# Altium schematic sheet MR26_GSS_6.SchDoc
size 373 x 296 mm; Origin: Eagle; OriginPath: C:\Users\David Nguyen\Downloads\eagle\eagle\MR26_GSS.sch; OriginSheet: 7; OriginDescription: 08 Sensors: IMU, 3x ToF, GNSS
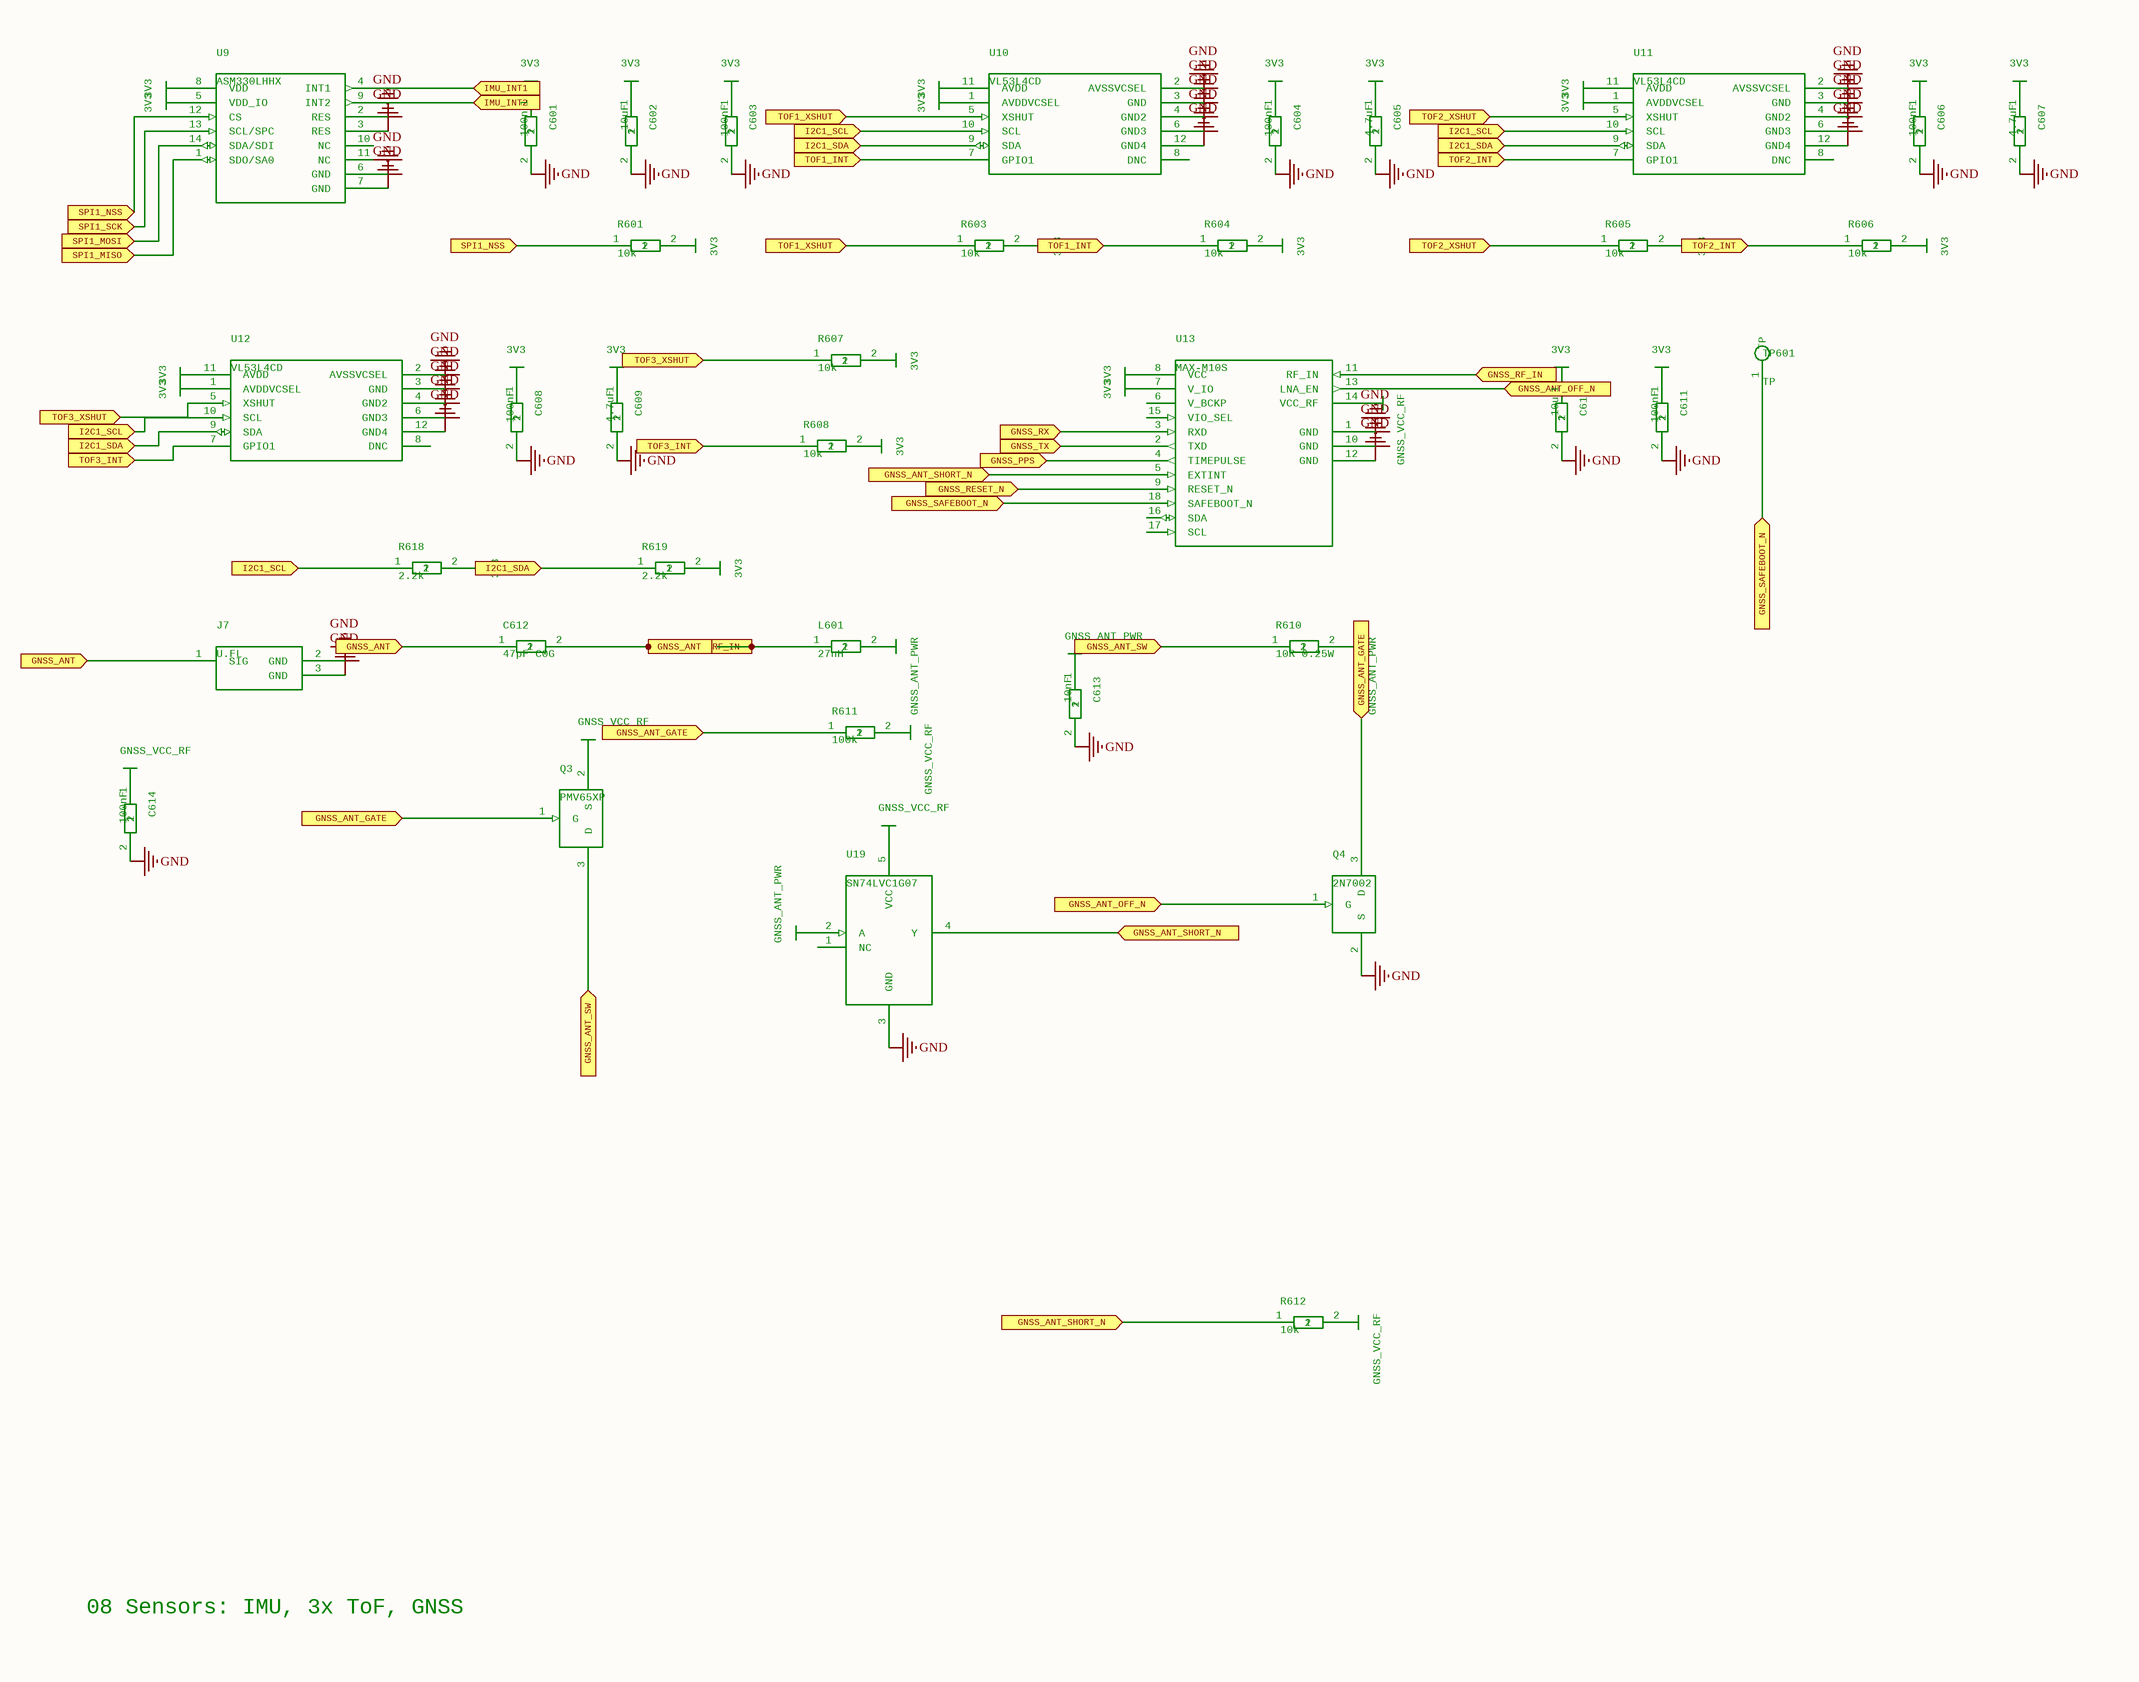
[diagram p0: MR26_GSS_6.SchDoc]

## Parts
C601  100nF  [C_0402]
C602  10uF  [C_0603]
C603  100nF  [C_0402]
C604  100nF  [C_0402]
C605  4.7uF  [C_0603]
C606  100nF  [C_0402]
C607  4.7uF  [C_0603]
C608  100nF  [C_0402]
C609  4.7uF  [C_0603]
C610  10uF  [C_0603]
C611  100nF  [C_0402]
C612  47pF C0G  [C_0402]
C613  10nF  [C_0402]
C614  100nF  [C_0402]
J7  U.FL  [U.FL_Hirose]
L601  27nH  [L_0402]
PWR0492  3V3
PWR0493  3V3
PWR0498  3V3
PWR0500  3V3
PWR0502  3V3
PWR0504  3V3
PWR0505  3V3
PWR0506  3V3
PWR0512  3V3
PWR0514  3V3
PWR0516  3V3
PWR0517  3V3
PWR0518  3V3
PWR0519  3V3
PWR0525  3V3
PWR0527  3V3
PWR0529  3V3
PWR0530  3V3
PWR0531  3V3
PWR0532  3V3
PWR0538  3V3
PWR0540  3V3
PWR0542  3V3
PWR0543  3V3
PWR0544  3V3
PWR0545  3V3
PWR0546  3V3
PWR0547  3V3
PWR0548  GNSS_VCC_RF
PWR0552  3V3
PWR0554  3V3
PWR0558  GNSS_ANT_PWR
PWR0559  GNSS_ANT_PWR
PWR0561  GNSS_ANT_PWR
PWR0562  GNSS_VCC_RF
PWR0563  GNSS_VCC_RF
PWR0565  GNSS_ANT_PWR
PWR0566  GNSS_VCC_RF
PWR0568  GNSS_VCC_RF
PWR0570  GNSS_VCC_RF
Q3  PMV65XP  [SOT-23]
Q4  2N7002  [SOT-23]
R601  10k  [R_0402]
R603  10k  [R_0402]
R604  10k  [R_0402]
R605  10k  [R_0402]
R606  10k  [R_0402]
R607  10k  [R_0402]
R608  10k  [R_0402]
R610  10R 0.25W  [R_0603]
R611  100k  [R_0402]
R612  10k  [R_0402]
R618  2.2k  [R_0402]
R619  2.2k  [R_0402]
TP601  TP  [TP_1.0mm]
U9  ASM330LHHX  [LGA-14L_2.5x3]
U10  VL53L4CD  [VL53L4CD_LGA12]
U11  VL53L4CD  [VL53L4CD_LGA12]
U12  VL53L4CD  [VL53L4CD_LGA12]
U13  MAX-M10S  [u-blox_LCC-18_9.7x10.1]
U19  SN74LVC1G07  [SOT-23-5]

## Ports
GNSS_ANT (in), GNSS_ANT_GATE (in), GNSS_ANT_OFF_N (in), GNSS_ANT_SHORT_N (in), GNSS_ANT_SW (in), GNSS_PPS (in), GNSS_RESET_N (in), GNSS_RF_IN (in), GNSS_RX (in), GNSS_SAFEBOOT_N (in), GNSS_TX (in), I2C1_SCL (in), I2C1_SDA (in), IMU_INT1 (in), IMU_INT2 (in), SPI1_MISO (in), SPI1_MOSI (in), SPI1_NSS (in), SPI1_SCK (in), TOF1_INT (in), TOF1_XSHUT (in), TOF2_INT (in), TOF2_XSHUT (in), TOF3_INT (in), TOF3_XSHUT (in)

## Nets
GND: C601.2 C602.2 C603.2 C604.2 C605.2 C606.2 C607.2 C608.2 C609.2 C610.2 C611.2 C613.2 C614.2 J7.2(GND) J7.3(GND) Q4.2(S) U9.2(RES) U9.3(RES) U9.6(GND) U9.7(GND) U10.2(AVSSVCSEL) U10.3(GND) U10.4(GND2) U10.6(GND3) U10.12(GND4) U11.2(AVSSVCSEL) U11.3(GND) U11.4(GND2) U11.6(GND3) U11.12(GND4) U12.2(AVSSVCSEL) U12.3(GND) U12.4(GND2) U12.6(GND3) U12.12(GND4) U13.1(GND) U13.10(GND) U13.12(GND) U19.3(GND)
GNSS_ANT: C612.1 C612.2 J7.1(SIG) L601.1 U13.11(RF_IN) ; port GNSS_RF_IN, port GNSS_ANT
GNSS_ANT_GATE: Q3.1(G) Q4.3(D) R611.1 ; port GNSS_ANT_GATE
GNSS_ANT_OFF_N: Q4.1(G) U13.13(LNA_EN) ; port GNSS_ANT_OFF_N
GNSS_ANT_SHORT_N: R612.1 U13.5(EXTINT) U19.4(Y) ; port GNSS_ANT_SHORT_N
GNSS_ANT_SW: Q3.3(D) R610.1 ; port GNSS_ANT_SW
GNSS_PPS: U13.4(TIMEPULSE) ; port GNSS_PPS
GNSS_RESET_N: U13.9(RESET_N) ; port GNSS_RESET_N
GNSS_RX: U13.3(RXD) ; port GNSS_RX
GNSS_SAFEBOOT_N: TP601.1(TP) U13.18(SAFEBOOT_N) ; port GNSS_SAFEBOOT_N
GNSS_TX: U13.2(TXD) ; port GNSS_TX
I2C1_SCL: R607.1 R618.1 U10.10(SCL) U11.10(SCL) U12.5(XSHUT) U12.10(SCL) ; port I2C1_SCL, port TOF3_XSHUT
I2C1_SDA: R619.1 U10.9(SDA) U11.9(SDA) U12.9(SDA) ; port I2C1_SDA
IMU_INT1: U9.4(INT1) ; port IMU_INT1
IMU_INT2: U9.9(INT2) ; port IMU_INT2
SPI1_MISO: U9.1(SDO/SA0) ; port SPI1_MISO
SPI1_MOSI: U9.14(SDA/SDI) ; port SPI1_MOSI
SPI1_NSS: R601.1 U9.12(CS) ; port SPI1_NSS
SPI1_SCK: U9.13(SCL/SPC) ; port SPI1_SCK
TOF1_INT: R604.1 U10.7(GPIO1) ; port TOF1_INT
TOF1_XSHUT: R603.1 U10.5(XSHUT) ; port TOF1_XSHUT
TOF2_INT: R606.1 U11.7(GPIO1) ; port TOF2_INT
TOF2_XSHUT: R605.1 U11.5(XSHUT) ; port TOF2_XSHUT
TOF3_INT: R608.1 U12.7(GPIO1) ; port TOF3_INT
NetC601_1: C601.1 PWR0498.?1(3V3)
NetC602_1: C602.1 PWR0500.?1(3V3)
NetC603_1: C603.1 PWR0502.?1(3V3)
NetC604_1: C604.1 PWR0512.?1(3V3)
NetC605_1: C605.1 PWR0514.?1(3V3)
NetC606_1: C606.1 PWR0525.?1(3V3)
NetC607_1: C607.1 PWR0527.?1(3V3)
NetC608_1: C608.1 PWR0538.?1(3V3)
NetC609_1: C609.1 PWR0540.?1(3V3)
NetC610_1: C610.1 PWR0552.?1(3V3)
NetC611_1: C611.1 PWR0554.?1(3V3)
NetC613_1: C613.1 PWR0559.?1(GNSS_ANT_PWR)
NetC614_1: C614.1 PWR0568.?1(GNSS_VCC_RF)
NetL601_2: L601.2 PWR0558.?1(GNSS_ANT_PWR)
NetPWR0492_?1: PWR0492.?1(3V3) U9.8(VDD)
NetPWR0493_?1: PWR0493.?1(3V3) U9.5(VDD_IO)
NetPWR0504_?1: PWR0504.?1(3V3) R601.2
NetPWR0505_?1: PWR0505.?1(3V3) U10.11(AVDD)
NetPWR0506_?1: PWR0506.?1(3V3) U10.1(AVDDVCSEL)
NetPWR0516_?1: PWR0516.?1(3V3) R603.2
NetPWR0517_?1: PWR0517.?1(3V3) R604.2
NetPWR0518_?1: PWR0518.?1(3V3) U11.11(AVDD)
NetPWR0519_?1: PWR0519.?1(3V3) U11.1(AVDDVCSEL)
NetPWR0529_?1: PWR0529.?1(3V3) R605.2
NetPWR0530_?1: PWR0530.?1(3V3) R606.2
NetPWR0531_?1: PWR0531.?1(3V3) U12.11(AVDD)
NetPWR0532_?1: PWR0532.?1(3V3) U12.1(AVDDVCSEL)
NetPWR0542_?1: PWR0542.?1(3V3) R607.2
NetPWR0543_?1: PWR0543.?1(3V3) R608.2
NetPWR0544_?1: PWR0544.?1(3V3) R618.2
NetPWR0545_?1: PWR0545.?1(3V3) R619.2
NetPWR0546_?1: PWR0546.?1(3V3) U13.8(VCC)
NetPWR0547_?1: PWR0547.?1(3V3) U13.7(V_IO)
NetPWR0548_?1: PWR0548.?1(GNSS_VCC_RF) U13.14(VCC_RF)
NetPWR0561_?1: PWR0561.?1(GNSS_ANT_PWR) R610.2
NetPWR0562_?1: PWR0562.?1(GNSS_VCC_RF) Q3.2(S)
NetPWR0563_?1: PWR0563.?1(GNSS_VCC_RF) R611.2
NetPWR0565_?1: PWR0565.?1(GNSS_ANT_PWR) U19.2(A)
NetPWR0566_?1: PWR0566.?1(GNSS_VCC_RF) U19.5(VCC)
NetPWR0570_?1: PWR0570.?1(GNSS_VCC_RF) R612.2

Not connected (* = marked no-connect by the designer): U9 10(NC) 11(NC); U10 8(DNC); U11 8(DNC); U12 8(DNC); U13 6(V_BCKP) 15(VIO_SEL) 16(SDA) 17(SCL); U19 1(NC)

## Notes on the sheet
- 08 Sensors: IMU, 3x ToF, GNSS

## Library data of the parts
C601 C603 C604 C606 C608 C611 C614 = CAPC_0402: MPN: CAP 100nF 0402; GateName_1: G$1; SymbolName_1: CAP; DeviceName: C_0402; LibraryName: MR26; DeviceSetName: CAP
C602 C610 = CAPC_0603: MPN: CAP 10uF 0603; GateName_1: G$1; SymbolName_1: CAP; DeviceName: C_0603; LibraryName: MR26; DeviceSetName: CAP
C605 C607 C609 = CAPC_0603: MPN: CAP 4.7uF 0603; GateName_1: G$1; SymbolName_1: CAP; DeviceName: C_0603; LibraryName: MR26; DeviceSetName: CAP
C612 = CAPC_0402: MPN: CAP 47pF C0G 0402; GateName_1: G$1; SymbolName_1: CAP; DeviceName: C_0402; LibraryName: MR26; DeviceSetName: CAP
C613 = CAPC_0402: MPN: CAP 10nF 0402; GateName_1: G$1; SymbolName_1: CAP; DeviceName: C_0402; LibraryName: MR26; DeviceSetName: CAP
J7 = UFLU.FL_Hirose: MPN: Hirose U.FL-R-SMT-1(10); GateName_1: G$1; SymbolName_1: UFL; DeviceName: U.FL_Hirose; LibraryName: MR26; DeviceSetName: UFL
L601 = INDL_0402: MPN: Murata LQG15HS27NJ02D; GateName_1: G$1; SymbolName_1: IND; DeviceName: L_0402; LibraryName: MR26; DeviceSetName: IND
PWR0492 PWR0493 PWR0498 PWR0500 PWR0502 PWR0504 PWR0505 PWR0506 PWR0512 PWR0514 PWR0516 PWR0517 PWR0518 PWR0519 PWR0525 PWR0527 PWR0529 PWR0530 PWR0531 PWR0532 PWR0538 PWR0540 PWR0542 PWR0543 PWR0544 PWR0545 PWR0546 PWR0547 PWR0552 PWR0554 = PWR_3V3: GateName_1: G$1; SymbolName_1: PWR_3V3; LibraryName: MR26; DeviceSetName: PWR_3V3
PWR0548 PWR0562 PWR0563 PWR0566 PWR0568 PWR0570 = PWR_GNSS_VCC_RF: GateName_1: G$1; SymbolName_1: PWR_GNSS_VCC_RF; LibraryName: MR26; DeviceSetName: PWR_GNSS_VCC_RF
PWR0558 PWR0559 PWR0561 PWR0565 = PWR_GNSS_ANT_PWR: GateName_1: G$1; SymbolName_1: PWR_GNSS_ANT_PWR; LibraryName: MR26; DeviceSetName: PWR_GNSS_ANT_PWR
Q3 = PMOS_SOT23SOT-23: MPN: PMV65XP,215; GateName_1: G$1; SymbolName_1: PMOS_SOT23; DeviceName: SOT-23; LibraryName: MR26; DeviceSetName: PMOS_SOT23
Q4 = NMOS_SOT23SOT-23: MPN: 2N7002,215; GateName_1: G$1; SymbolName_1: NMOS_SOT23; DeviceName: SOT-23; LibraryName: MR26; DeviceSetName: NMOS_SOT23
R601 R603-R608 R612 = RESR_0402: MPN: RES 10k 0402; GateName_1: G$1; SymbolName_1: RES; DeviceName: R_0402; LibraryName: MR26; DeviceSetName: RES
R610 = RESR_0603: MPN: RES 10R 0.25W 0603; GateName_1: G$1; SymbolName_1: RES; DeviceName: R_0603; LibraryName: MR26; DeviceSetName: RES
R611 = RESR_0402: MPN: RES 100k 0402; GateName_1: G$1; SymbolName_1: RES; DeviceName: R_0402; LibraryName: MR26; DeviceSetName: RES
R618 R619 = RESR_0402: MPN: RES 2.2k 0402; GateName_1: G$1; SymbolName_1: RES; DeviceName: R_0402; LibraryName: MR26; DeviceSetName: RES
TP601 = TESTPOINTTP_1.0mm: MPN: Keystone 5019 / 1.0 mm pad; GateName_1: G$1; SymbolName_1: TESTPOINT; DeviceName: TP_1.0mm; LibraryName: MR26; DeviceSetName: TESTPOINT
U9 = ASM330LHHX_LGA14LGA-14L_2.5x3: MPN: ASM330LHHXTR; GateName_1: G$1; SymbolName_1: ASM330LHHX_LGA14; DeviceName: LGA-14L_2.5x3; LibraryName: MR26; DeviceSetName: ASM330LHHX_LGA14
U10-U12 = VL53L4CD_LGA12VL53L4CD_LGA12: MPN: VL53L4CDV0DH/1; GateName_1: G$1; SymbolName_1: VL53L4CD_LGA12; DeviceName: VL53L4CD_LGA12; LibraryName: MR26; DeviceSetName: VL53L4CD_LGA12
U13 = MAX-M10Su-blox_LCC-18_9.7x10.1: MPN: MAX-M10S-00B; GateName_1: G$1; SymbolName_1: MAX-M10S; DeviceName: u-blox_LCC-18_9.7x10.1; LibraryName: MR26; DeviceSetName: MAX-M10S
U19 = SN74LVC1G07_SOT23SOT-23-5: MPN: SN74LVC1G07DBVR; GateName_1: G$1; SymbolName_1: SN74LVC1G07_SOT23; DeviceName: SOT-23-5; LibraryName: MR26; DeviceSetName: SN74LVC1G07_SOT23